# EAGLE design Arduino_MITCH_PCB (EAGLE 9.6.2)
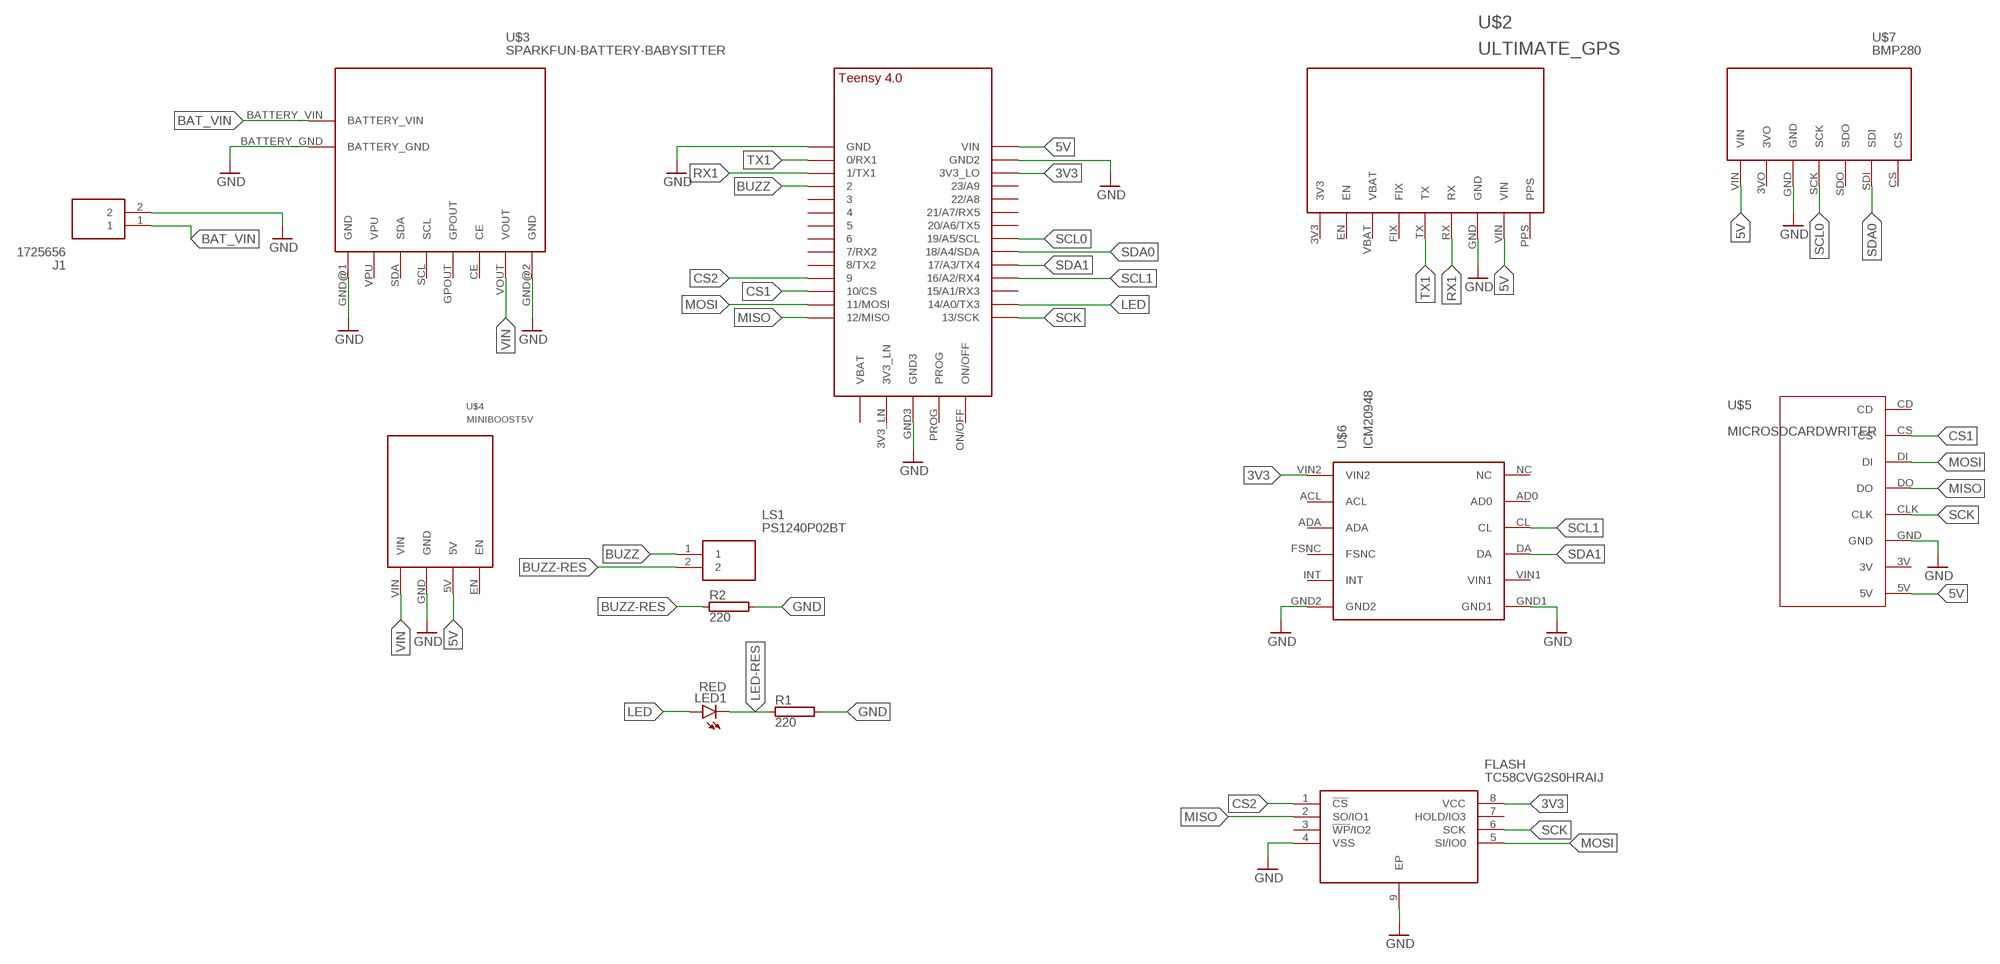
[diagram p0: schematic, sheet 1]

## Parts
FLASH  TC58CVG2S0HRAIJ  [SON127P800X600X80-9N]
J1  1725656  [1725656]
LED1  RED  LED5MM  [LED5MM]
LS1  PS1240P02BT  [PS1240P02BT]
R1  220  RHPS58  [HPS58]
R2  220  RHPS58  [HPS58]
U$1  TEENSY_4.0-BASIC  [TEENSY_4.0-BASIC]
U$2  ULTIMATE_GPS  [ULTIMATE_GPS]
U$3  SPARKFUN-BATTERY-BABYSITTER  [SPARKFUN-BATTERY-BABYSITTER]
U$4  MINIBOOST5V  [MINIBOOST5V]
U$5  MICROSDCARDWRITER  [MICROSDCARDWRITER]
U$6  ICM20948  [ICM20948]
U$7  BMP280  [BMP280]

## Nets
3V3: FLASH.8(VCC) U$1.3V3_LO U$6.VIN2
5V: U$1.VIN U$2.VIN U$4.5V U$5.5V U$7.VIN
BAT_VIN: J1.1 U$3.BATTERY_VIN
BUZZ: LS1.1 U$1.2
BUZZ-RES: LS1.2 R2.1
CS1: U$1.10/CS U$5.CS
CS2: FLASH.1(!CS) U$1.9/CS
GND: FLASH.4(VSS) FLASH.9(EP) J1.2 R1.2 R2.2 U$1.GND U$1.GND2 U$1.GND3 U$2.GND U$3.BATTERY_GND U$3.GND@1(GND) U$3.GND@2(GND) U$4.GND U$5.GND U$6.GND1 U$6.GND2 U$7.GND
LED: LED1.A U$1.14/A0(14/A0/TX3)
LED-RES: LED1.K(C) R1.1
MISO: FLASH.2(SO/IO1) U$1.12/MISO U$5.DO
MOSI: FLASH.5(SI/IO0) U$1.11/MOSI U$5.DI
RX1: U$1.1/TX(1/TX1) U$2.RX
SCK: FLASH.6(SCK) U$1.13/SCK U$5.CLK
SCL0: U$1.19/A5/SCL U$7.SCK
SCL1: U$1.16/A2(16/A2/RX4) U$6.CL
SDA0: U$1.18/A4/SDA U$7.SDI
SDA1: U$1.17/A3(17/A3/TX4) U$6.DA
TX1: U$1.0/RX(0/RX1) U$2.TX
VIN: U$3.VOUT U$4.VIN
Unconnected: FLASH.3(!WP!/IO2) FLASH.7(HOLD/IO3) U$1.3/CANTX U$1.3V3_LN U$1.4/CANRX U$1.5 U$1.6 U$1.7(7/RX2) U$1.8(8/TX2) U$1.15/A1(15/A1/RX3) U$1.20/A6(20/A6/TX5) U$1.21/A7(21/A7/RX5) U$1.22/A8 U$1.23/A9 U$1.ON/OFF U$1.PROG U$1.VBAT\(VBAT) U$2.3V3 U$2.EN U$2.FIX U$2.PPS U$2.VBAT U$3.CE U$3.GPOUT U$3.SCL U$3.SDA U$3.VPU U$4.EN U$5.3V U$5.CD U$6.ACL U$6.AD0 U$6.ADA U$6.FSNC U$6.INT U$6.NC U$6.VIN1 U$7.3VO U$7.CS U$7.SDO

## Library data of the parts
FLASH = Arduino-MITCH_Breakouts:TC58CVG2S0HRAIJ: NAND Flash 4G-bit 128M X 8bit Serial 8-Pin WSON Source: Datasheet <https://business.kioxia.com/en-us/memory/detail.TC58CVG2S0HRAIJ.html>; DESCRIPTION: NAND Flash 4G-bit 128M X 8bit Serial 8-Pin WSON; HEIGHT: 0.8mm; MANUFACTURER_NAME: Kioxia America; MANUFACTURER_PART_NUMBER: TC58CVG2S0HRAIJ; MOUSER_PART_NUMBER: 757-TC58CVG2S0HRAIJ; MOUSER_PRICE-STOCK: https://www.mouser.co.uk/ProductDetail/Kioxia-America/TC58CVG2S0HRAIJ?qs=OlC7AqGiEDkQEWU%2FaAG3Ug%3D%3D
J1 = Arduino-MITCH_Breakouts:1725656: 2 way PCB vertical mount terminal,2.54mm 2 way PCB vertical mount terminal,2.54mm Source: Datasheet <https://www.phoenixcontact.com/online/portal/gb?uri=pxc-oc-itemdetail:pid=1725656&library=gben&tab=1>; DESCRIPTION: 2 way PCB vertical mount terminal,2.54mm 2 way PCB vertical mount terminal,2.54mm; HEIGHT: 8mm; MANUFACTURER_NAME: Phoenix Contact; MANUFACTURER_PART_NUMBER: 1725656; MOUSER_PART_NUMBER: 651-1725656; MOUSER_PRICE-STOCK: https://www.mouser.co.uk/ProductDetail/Phoenix-Contact/1725656?qs=Ul7CXFMnlWWQeccayYbRmw%3D%3D
LED1 = led:LED: LED OSRAM: - CHIPLED LG R971, LG N971, LY N971, LG Q971, LY Q971, LO R971, LY R971 LH N974, LH R974 LS Q976, LO Q976, LY Q976 LO Q996 - Hyper CHIPLED LW Q18S LB Q993, LB Q99A, LB R99A - SideLED LS A670, LO A670, LY A670, LG A670, LP A670 LB A673, LV A673, LT A673, LW A673 LH A674 LY A675 LS A676, LA A676, LO A676, LY A676, LW A676 LS A679, LY A679, LG A679 - Hyper Micro SIDELED® LS Y876, LA Y876, LO Y876, LY Y876 LT Y87S - SmartLED LW L88C, LW L88S LB L89C, LB L89S, LG L890 LS L89K, LO L89K, LY L89K LS L896, LA L896, LO L896, LY L896 - TOPLED LS T670, LO T670, LY T670, LG T670, LP T670 LSG T670, LSP T670, LSY T670, LOP T670, LYG T670 LG T671, LOG T671, LSG T671 LB T673, LV T673, LT T673, LW T673 LH T674 LS T676, LA T676, LO T676, LY T676, LB T676, LH T676, LSB T676, LW T676 LB T67C, LV T67C, LT T67C, LS T67K, LO T67K, LY T67K, LW E67C LS E67B, LA E67B, LO E67B, LY E67B, LB E67C, LV E67C, LT E67C LW T67C LS T679, LY T679, LG T679 LS T770, LO T770, LY T770, LG T770, LP T770 LB T773, LV T773, LT T773, LW T773 LH T774 LS E675, LA E675, LY E675, LS T675 LS T776, LA T776, LO T776, LY T776, LB T776 LHGB T686 LT T68C, LB T68C - Hyper Mini TOPLED® LB M676 - Mini TOPLED Santana® LG M470 LS M47K, LO M47K, LY M47K Source: http://www.osram.convergy.de LUXEON: - LUMILED® LXK2-PW12-R00, LXK2-PW12-S00, LXK2-PW14-U00, LXK2-PW14-V00 LXK2-PM12-R00, LXK2-PM12-S00, LXK2-PM14-U00 LXK2-PE12-Q00, LXK2-PE12-R00, LXK2-PE12-S00, LXK2-PE14-T00, LXK2-PE14-U00 LXK2-PB12-K00, LXK2-PB12-L00, LXK2-PB12-M00, LXK2-PB14-N00, LXK2-PB14-P00, LXK2-PB14-Q00 LXK2-PR12-L00, LXK2-PR12-M00, LXK2-PR14-Q00, LXK2-PR14-R00 LXK2-PD12-Q00, LXK2-PD12-R00, LXK2-PD12-S00 LXK2-PH12-R00, LXK2-PH12-S00 LXK2-PL12-P00, LXK2-PL12-Q00, LXK2-PL12-R00 Source: www.luxeon.com KINGBRIGHT: KA-3528ASYC Source: www.kingbright.com
LS1 = SamacSys_Parts:PS1240P02BT: Audio Indicators & Alerts Round 12.2mmx6.5mm 4kHz Vin=3V Source: Datasheet; DESCRIPTION: Audio Indicators & Alerts Round 12.2mmx6.5mm 4kHz Vin=3V; HEIGHT: mm; MANUFACTURER_NAME: TDK; MANUFACTURER_PART_NUMBER: PS1240P02BT; MOUSER_PART_NUMBER: 810-PS1240P02BT; MOUSER_PRICE-STOCK: https://www.mouser.co.uk/ProductDetail/TDK/PS1240P02BT?qs=d7g9p1yFhWaZXSY9MjKMkw%3D%3D
R1 R2 = resistor-power:R: Power Resitor; OC_FARNELL: unknown; OC_NEWARK: unknown
U$1 = Arduino-MITCH_Breakouts:TEENSY_4.0-BASIC
U$2 = Arduino-MITCH_Breakouts:ULTIMATE_GPS
U$3 = Arduino-MITCH_Breakouts:SPARKFUN-BATTERY-BABYSITTER
U$4 = Arduino-MITCH_Breakouts:MINIBOOST5V
U$5 = Arduino-MITCH_Breakouts:MICROSDCARDWRITER
U$6 = Arduino-MITCH_Breakouts:ICM20948
U$7 = Arduino-MITCH_Breakouts:BMP280

## Board
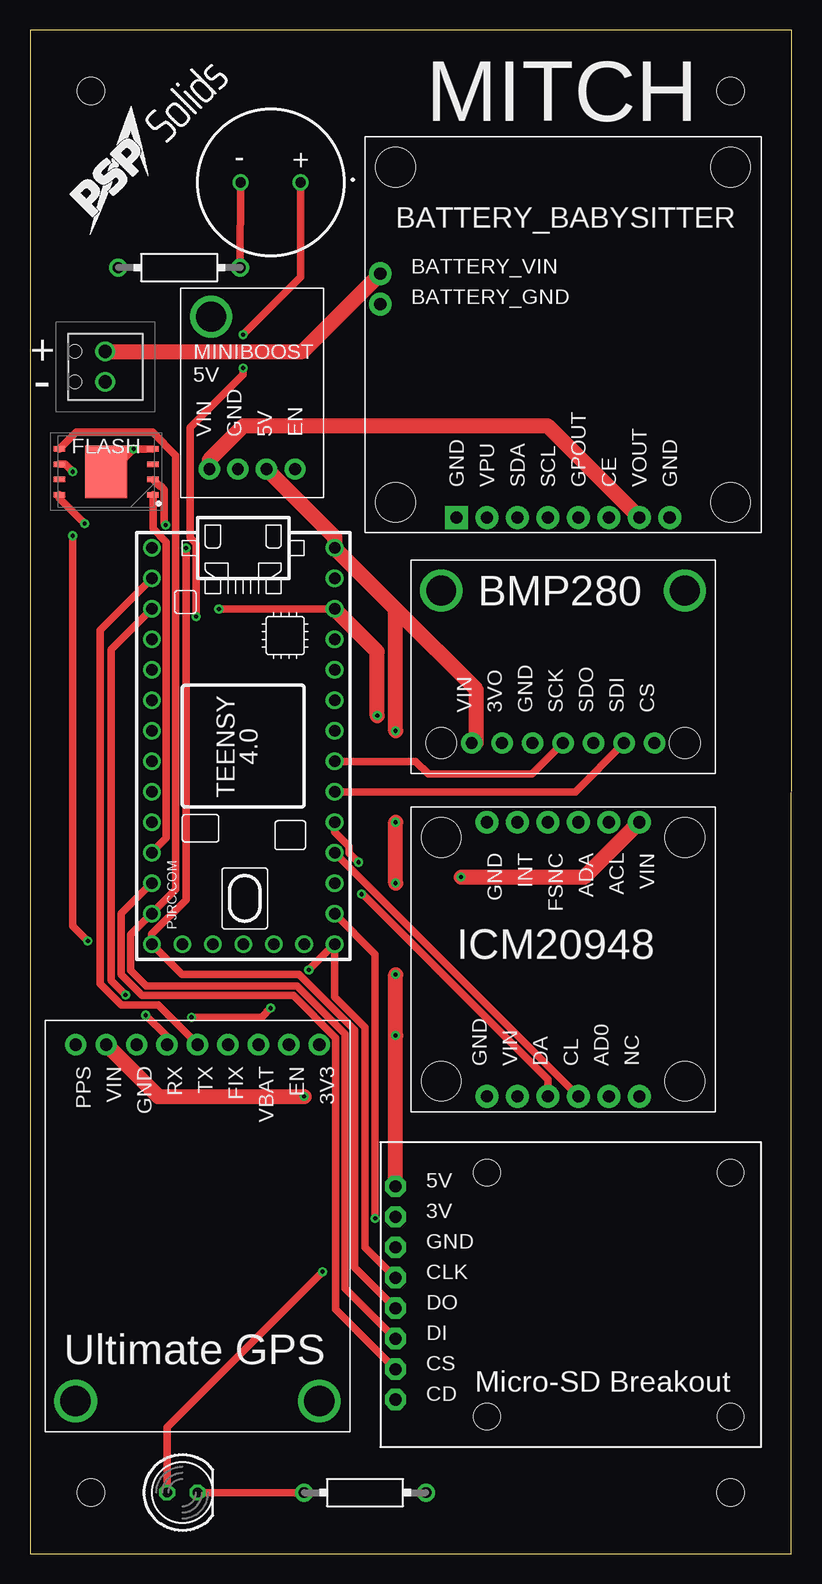
[diagram p1: board, top side]
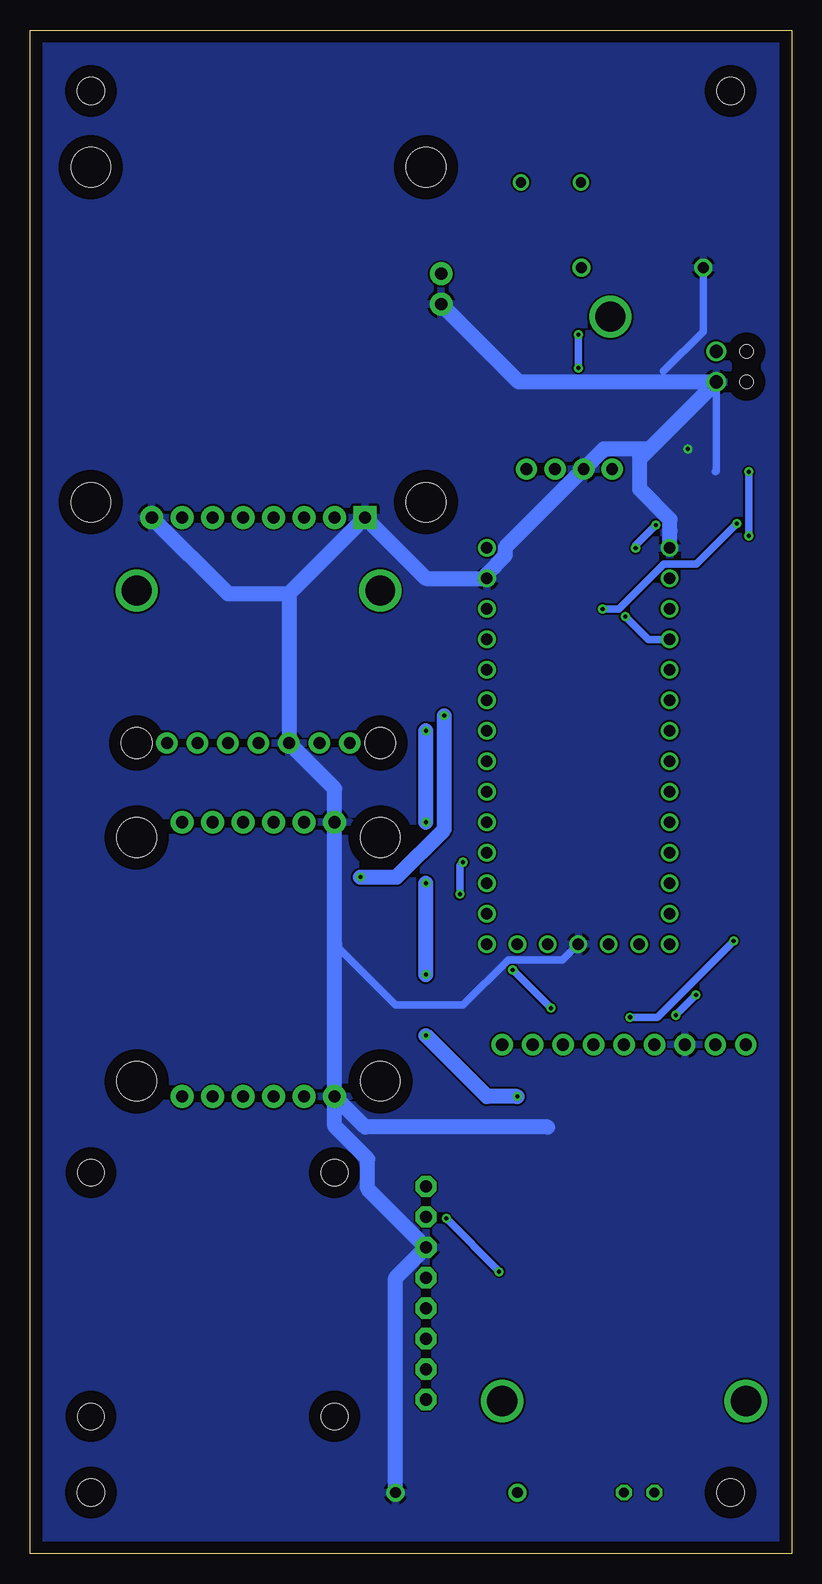
[diagram p2: board, bottom side, seen from below]

Size 63.5 x 127 mm. Coordinates in mm from the lower left corner, seen from the top.
Outline: 0,0 63.48,0 63.5,127 0,127 0,0
Copper layers (1*16): Top 0.035mm / dielectric 1.5mm / Bottom 0.035mm
Design rules "default": minimum track width 6mil, minimum drill 0.35mm, track to track 6mil, track to pad 6mil, pad to pad 6mil, via to via 6mil, smd to smd 6mil, copper to edge 40mil, drill to drill 6mil, minimum pad ring 10mil, minimum via ring 8mil, stop-mask expansion 4mil, vias tented up to drill 0mil, thermal gap 10mil
Holes 2.26 mm at 58.42,5.08 5.08,121.92 58.42,121.92 5.08,5.08

### Footprints (pad centres in the part's own frame; a part is rotated, then mirrored left to right if it is on the bottom)
SON127P800X600X80-9N = smd 0.95 x 0.45: 1 -3.9,1.905; 2 -3.9,0.635; 3 -3.9,-0.635; 4 -3.9,-1.905; 5 3.9,-1.905; 6 3.9,-0.635; 7 3.9,0.635; 8 3.9,1.905 | smd 3.5 x 4.4: 9 0,0
1725656 = drill 1.1 pad 1.65: 1 -1.27,3.1; 2 1.27,3.1 | hole 1.1: -1.27,0.56; 1.27,0.56
LED5MM = drill 0.813 octagon: A -1.27,0; K 1.27,0
PS1240P02BT = drill 0.85 pad 1.35: 1 0,2.5; 2 0,-2.5
HPS58 = drill 0.9 pad 1.5: 1 -5.08,0; 2 5.08,0
TEENSY_4.0-BASIC = drill 0.965: 0/RX -13.97,-7.62; 1/TX -11.43,-7.62; 2 -8.89,-7.62; 3/CANTX -6.35,-7.62; 3V3_LN 16.51,-2.54; 3V3_LO -11.43,7.62; 4/CANRX -3.81,-7.62; 5 -1.27,-7.62; 6 1.27,-7.62; 7 3.81,-7.62; 8 6.35,-7.62; 9/CS 8.89,-7.62; 10/CS 11.43,-7.62; 11/MOSI 13.97,-7.62; 12/MISO 16.51,-7.62; 13/SCK 16.51,7.62; 14/A0 13.97,7.62; 15/A1 11.43,7.62; 16/A2 8.89,7.62; 17/A3 6.35,7.62; 18/A4/SDA 3.81,7.62; 19/A5/SCL 1.27,7.62; 20/A6 -1.27,7.62; 21/A7 -3.81,7.62; 22/A8 -6.35,7.62; 23/A9 -8.89,7.62; GND -16.51,-7.62; GND2 -13.97,7.62; GND3 16.51,0; ON/OFF 16.51,5.08; PROG 16.51,2.54; VBAT\ 16.51,-5.08; VIN -16.51,7.62
ULTIMATE_GPS = drill 1.016 pad 1.778: 3V3 2.54,2.032; EN 5.08,2.032; FIX 10.16,2.032; GND 17.78,2.032; PPS 22.86,2.032; RX 15.24,2.032; TX 12.7,2.032; VBAT 7.62,2.032; VIN 20.32,2.032 | drill 2.54 pad 3.531: P$3 2.54,31.75; P$4 22.86,31.75
SPARKFUN-BATTERY-BABYSITTER = drill 1.016 pad 1.905: BATTERY_GND 1.27,19.05; BATTERY_VIN 1.27,21.59; CE 20.32,1.27; GND@2 25.4,1.27; GPOUT 17.78,1.27; SCL 15.24,1.27; SDA 12.7,1.27; VOUT 22.86,1.27; VPU 10.16,1.27 | drill 1.016 pad 1.905 square: GND@1 7.62,1.27 | hole 3.302: 2.54,2.54; 30.48,2.54; 30.48,30.48; 2.54,30.48
MINIBOOST5V = drill 0.991 pad 1.778: 5V 7.144,2.381; EN 9.525,2.381; GND 4.763,2.381; VIN 2.381,2.381 | drill 2.489 pad 3.302: P$5 2.54,15.081
MICROSDCARDWRITER = drill 1.016 pad 1.778 octagon: 3V 30.48,6.223; 5V 30.48,3.683; CD 30.48,21.463; CLK 30.48,11.303; CS 30.48,18.923; DI 30.48,16.383; DO 30.48,13.843; GND 30.48,8.763 | hole 2.2: 22.86,22.86; 2.54,22.86; 2.54,2.54; 22.86,2.54
ICM20948 = drill 1.016 pad 1.905: ACL 16.51,24.13; AD0 16.51,1.27; ADA 13.97,24.13; CL 13.97,1.27; DA 11.43,1.27; FSNC 11.43,24.13; GND1 6.35,1.27; GND2 6.35,24.13; INT 8.89,24.13; NC 19.05,1.27; VIN1 8.89,1.27; VIN2 19.05,24.13 | hole 3.302: 2.54,22.86; 22.86,22.86; 2.54,2.54; 22.86,2.54
BMP280 = drill 0.991 pad 1.778: 3VO 7.62,2.54; CS 20.32,2.54; GND 10.16,2.54; SCK 12.7,2.54; SDI 17.78,2.54; SDO 15.24,2.54; VIN 5.08,2.54 | drill 2.489 pad 3.302: P$1 2.54,15.24; P$2 22.86,15.24 | hole 2.54: 2.54,2.54; 22.86,2.54

### Placement (x,y rotation side)
FLASH  6.35,90.17 180 top
J1  3.17,98.93 270 top
LED1  12.7,5.08 0 top
LS1  20.07,114.3 270 top
R1  27.94,5.08 0 top
R2  12.45,107.19 180 top
U$1  17.78,67.31 270 top
U$2  26.67,44.45 180 top
U$3  27.94,85.09 0 top
U$4  12.57,88.01 0 top
U$5  60.96,34.29 180 top
U$6  31.75,36.83 0 top
U$7  31.75,65.02 0 top

### Tracks (layer width: path | path; a pad name or v marks a point on that pad's centre or on a via)
3V3  (via drill 0.35)
  Top 0.635: v4.57,85.85 2.45,87.97 FLASH.8 | U$1.3V3_LO v15.75,78.74
  Top 1.27: v35.94,56.39 46.23,56.39 U$6.VIN2 | v28.96,69.85 28.96,75.18 U$1.3V3_LO
  Bottom 0.635: v4.57,85.85 7.94,82.49 10.66,82.49 14.41,78.74 v15.75,78.74
  Bottom 1.27: v35.94,56.39 32.92,56.39 28.96,60.35 v28.96,69.85
5V  (via drill 0.35)
  Top 1.27: U$4.5V 25.4,84.71 U$1.VIN 30.48,78.74 | U$5.5V v30.48,43.18 v30.48,48.26 | v30.48,55.88 v30.48,60.96 | v30.48,68.58 30.48,78.74 | U$2.VIN 10.67,38.1 v22.86,38.1 | 30.48,78.74 37.21,72.01 37.21,67.56 U$7.VIN
  Bottom 1.27: v30.48,48.26 v30.48,55.88 | v30.48,60.96 v30.48,68.58 | v22.86,38.1 25.4,38.1 v30.48,43.18
BAT_VIN
  Top 1.27: J1.1 22.73,100.2 U$3.BATTERY_VIN
BUZZ  (via drill 0.35)
  Top 0.635: LS1.1 22.57,106.39 v17.78,101.6 | v13.85,78.1 13.85,84.17 13.34,84.69 13.34,93.85 13.36,93.85 17.78,98.28 v17.78,98.83
  Bottom 0.635: v13.85,78.1 11.95,76.2 U$1.2 | v17.78,98.83 v17.78,101.6
BUZZ-RES
  Top 0.635: LS1.2 R2.1
CS1
  Top 0.635: U$1.10/CS 7.62,53.34 7.62,48.26 9.37,46.51 21.96,46.51 25.49,42.98 25.49,20.36 U$5.CS
CS2
  Top 0.635: FLASH.1 10.25,85.44 11.37,84.32 11.37,59.63 U$1.9/CS
GND  (via drill 0.35)
  Top 0.635: FLASH.4 v8.64,92.08 | 8.26,92.08 v8.64,92.08 | v8.64,92.08 6.73,90.17 FLASH.9
  Bottom 0.635: U$1.GND3 19.08,49.5 23.6,49.5 27.38,45.72 33.02,45.72 38.1,50.8 | FLASH.9 6.28,90.25 J1.2 6.73,97.66 | R2.2 7.37,101.85 10.67,98.55
  Bottom 1.27: U$6.GND1 38.1,50.8 U$6.GND2 38.1,63.75 U$7.GND 41.91,80.01 | 41.91,80.01 U$3.GND@1 30.48,81.28 U$1.GND2 25.4,81.67 23.88,83.19 23.88,83.85 U$4.GND 17.32,90.39 15.65,92.07 11.87,92.07 | U$3.GND@2 46.99,80.01 41.91,80.01 | U$1.GND 10.16,85.22 10.14,85.24 10.14,86.21 12.65,88.72 12.65,91.29 11.87,92.07 | 11.87,92.07 J1.2 22.73,97.66 U$3.BATTERY_GND | 20.32,35.56 35.56,35.56 U$6.GND1 | U$6.GND1 38.1,35.64 35.35,32.89 35.35,30.4 U$5.GND 33.02,22.99 R1.2
  pour Bottom: 0,127 63.5,127 63.5,0 0,0
LED  (via drill 0.35)
  Top 0.635: U$1.14/A0 28.79,49.95 v28.79,27.94 | v24.38,23.5 11.43,10.54 LED1.A
  Bottom 0.635: v28.79,27.94 24.38,23.54 v24.38,23.5
LED-RES
  Top 0.635: LED1.K R1.1
MISO  (via drill 0.35)
  Top 0.635: U$5.DO 27.06,23.86 27.06,43.63 22.44,48.26 12.7,48.26 U$1.12/MISO 10.16,51.63 13,54.48 v13,83.82 | FLASH.2 10.82,88.96 10.92,88.96 11.2,88.69 11.2,85.84 v11.31,85.72
  Bottom 0.635: v11.31,85.72 13,84.03 v13,83.82
MOSI
  Top 0.635: U$5.DI 26.28,22.11 26.28,43.31 22.29,47.3 9.7,47.3 8.41,48.59 8.41,51.59 U$1.11/MOSI 12.15,55.33 12.15,91.54 10.22,93.47 3.85,93.47 FLASH.5
RX1  (via drill 0.35)
  Top 0.635: U$1.1/TX 6.76,75.34 6.76,47.78 v7.97,46.57 | v9.65,44.87 11.43,43.09 U$2.RX
  Bottom 0.635: v7.97,46.57 9.65,44.89 v9.65,44.87
SCK  (via drill 0.35)
  Top 0.635: U$5.CLK 27.94,25.53 27.94,43.87 25.4,46.41 U$1.13/SCK v23.25,48.65 | FLASH.6 2.92,90.81 v3.56,90.17 | v3.56,84.84 3.56,52.32 v4.83,51.05 | v20.07,45.47 19.3,44.7 v13.46,44.7
  Bottom 0.635: v3.56,84.84 v3.56,90.17 | v13.46,44.7 11.18,44.7 v4.83,51.05 | v23.25,48.65 v20.07,45.47
SCL0
  Top 0.635: U$1.19/A5/SCL 32.13,66.04 33.21,64.96 41.85,64.96 U$7.SCK
SCL1
  Top 0.635: U$6.CL U$1.16/A2
SDA0
  Top 0.635: U$7.SDI 45.47,63.5 U$1.18/A4/SDA
SDA1  (via drill 0.35)
  Top 0.635: U$6.DA 43.18,39.53 27.74,54.96 v27.66,54.96 | v27.4,57.62 26.61,58.41 26.61,58.92 25.4,60.13 U$1.17/A3
  Bottom 0.635: v27.66,54.96 27.66,57.36 v27.4,57.62
TX1
  Top 0.635: U$1.0/RX 5.84,76.96 5.84,47.5 7.62,45.72 10.67,45.72 U$2.TX
VIN
  Top 1.27: U$3.VOUT 43.18,93.98 17.78,93.98 14.95,91.15 U$4.VIN

### Text on the board
tPlace: - | + | + | -
tNames: MITCH